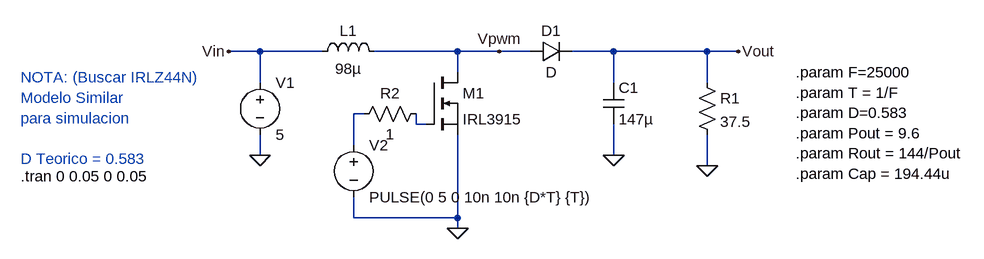
[diagram p0: schematic Test_1er.asc]
Test_1er.asc, the LTspice schematic file:
Version 4.1
SHEET 1 1048 680
WIRE -160 96 -208 96
WIRE -64 96 -160 96
WIRE 144 96 16 96
WIRE 208 96 144 96
WIRE 256 96 208 96
WIRE 384 96 320 96
WIRE 528 96 384 96
WIRE 576 96 528 96
WIRE 144 128 144 96
WIRE -160 144 -160 96
WIRE 384 144 384 96
WIRE 528 144 528 96
WIRE 0 192 -16 192
WIRE 80 208 80 192
WIRE 96 208 80 208
WIRE -16 240 -16 192
WIRE -160 256 -160 224
WIRE 384 256 384 208
WIRE 528 272 528 224
WIRE -16 352 -16 320
WIRE 144 352 144 224
WIRE 144 352 -16 352
WIRE 144 368 144 352
FLAG 144 368 0
FLAG -160 256 0
FLAG 384 256 0
FLAG 528 272 0
FLAG -208 96 Vin
FLAG 576 96 Vout
FLAG 208 96 Vpwm
SYMBOL nmos 96 128 R0
SYMATTR InstName M1
SYMATTR Value IRL3915
SYMBOL ind -80 112 R270
WINDOW 0 32 56 VTop 2
WINDOW 3 5 56 VBottom 2
SYMATTR InstName L1
SYMATTR Value 98µ
SYMBOL diode 256 112 R270
WINDOW 0 32 32 VTop 2
WINDOW 3 0 32 VBottom 2
SYMATTR InstName D1
SYMBOL cap 368 144 R0
SYMATTR InstName C1
SYMATTR Value 147µ
SYMBOL res 512 128 R0
SYMATTR InstName R1
SYMATTR Value 37.5
SYMBOL voltage -160 128 R0
WINDOW 123 0 0 Left 0
WINDOW 39 0 0 Left 0
SYMATTR InstName V1
SYMATTR Value 5
SYMBOL voltage -16 224 R0
WINDOW 123 0 0 Left 0
WINDOW 39 0 0 Left 0
SYMATTR InstName V2
SYMATTR Value PULSE(0 5 0 10n 10n {D*T} {T})
SYMBOL res 96 176 R90
WINDOW 0 0 56 VBottom 2
WINDOW 3 32 56 VTop 2
SYMATTR InstName R2
SYMATTR Value 1
TEXT -528 136 Left 2 ;NOTA: (Buscar IRLZ44N)\nModelo Similar \npara simulacion\n \nD Teorico = 0.583
TEXT 664 128 Left 2 !.param F=25000\n.param T = 1/F\n.param D=0.583\n.param Pout = 9.6\n.param Rout = 144/Pout\n.param Cap = 194.44u
TEXT -528 288 Left 2 !.tran 0 0.05 0 0.05

The netlist it stands for:
* Test_1er.asc
M1 Vpwm N002 0 0 IRL3915
L1 Vin Vpwm 98µ
D1 Vpwm Vout D
C1 Vout 0 147µ
R1 Vout 0 37.5
V1 Vin 0 5
V2 N001 0 PULSE(0 5 0 10n 10n {D*T} {T})
R2 N002 N001 1
.model D D
.lib standard.dio
.model NMOS NMOS
.model PMOS PMOS
.lib standard.mos
* NOTA: (Buscar IRLZ44N)
* Modelo Similar
* para simulacion
* D Teorico = 0.583
.param F=25000
.param T = 1/F
.param D=0.583
.param Pout = 9.6
.param Rout = 144/Pout
.param Cap = 194.44u
.tran 0 0.05 0 0.05
.backanno
.end